# Altium project HT1-1AA.PrjPcb
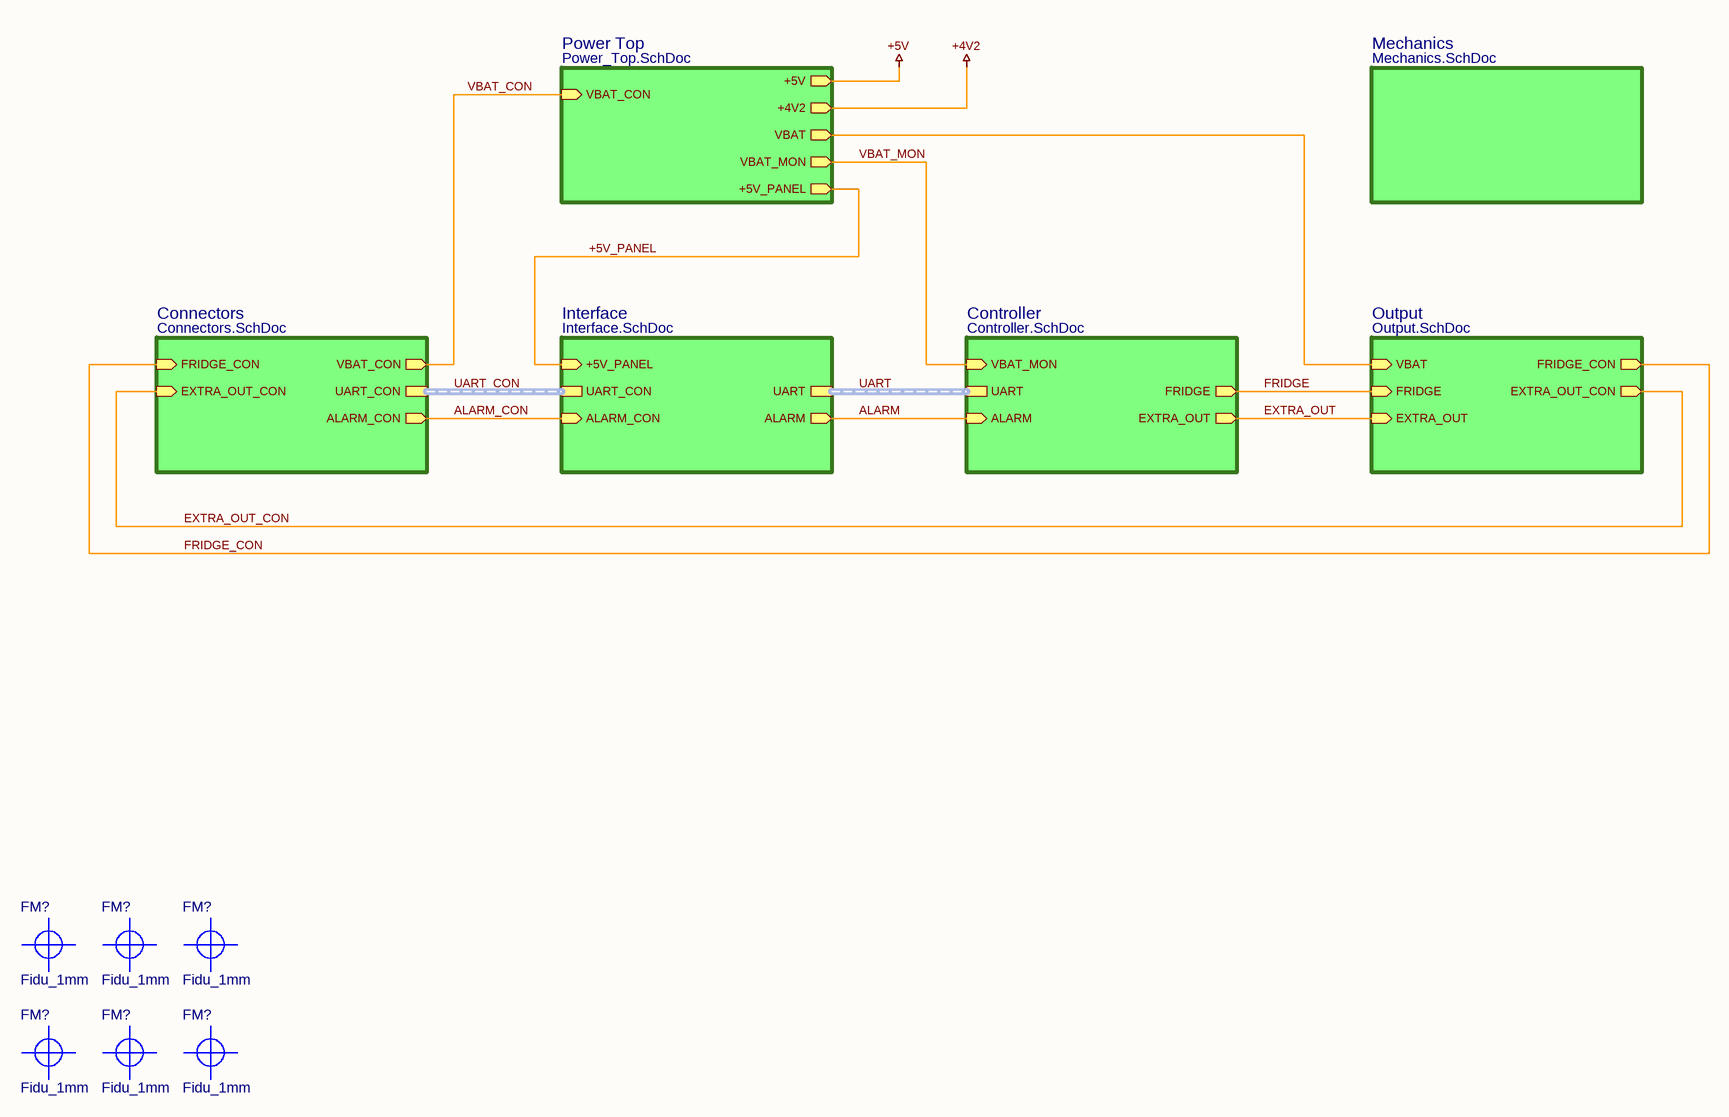
[diagram p0: HT1-1-Top.SchDoc]
Author: ahorat / daniw; Index_Main: A; Index_Sub: A; Layout_Designer: daniw; PCB_NAME: HT1-1; Project: HT Smart Control; Schema_Designer: daniw
10 sheets, 38 parts. Net scope: hierarchical (ports join the sheet entries above them; power ports are global).
Board files: HT1-1A-BASIS.PcbDoc, HT1-1A-PANEL.PcbDoc
Sheets:
  HT1-1-Top.SchDoc
    Controller = Controller.SchDoc
    Mechanics = Mechanics.SchDoc
    Interface = Interface.SchDoc
    Output = Output.SchDoc
    Power Top = Power_Top.SchDoc
      Power 5V = Power-5V.SchDoc
      Power 4.2V = Power-4V2.SchDoc
      Power 5V Panel = Power-5V-Panel.SchDoc
    Connectors = Connectors.SchDoc

## Sheet HT1-1-Top.SchDoc: Top
size A3; Author: daniw; SheetNumber: 1; SheetTotal: 10

### Parts
(Parts that share a designator on the sheet are numbered #1, #2 ... from top to bottom, then left to right.)
FM?#1  Fidu_1mm  [FIDU]  (no BOM)
FM?#2  Fidu_1mm  [FIDU]  (no BOM)
FM?#3  Fidu_1mm  [FIDU]  (no BOM)
FM?#4  Fidu_1mm  [FIDU]  (no BOM)
FM?#5  Fidu_1mm  [FIDU]  (no BOM)
FM?#6  Fidu_1mm  [FIDU]  (no BOM)

### Sub-sheets
Connectors = Connectors.SchDoc: UART_CON (harness UART), ALARM_CON (out), EXTRA_OUT_CON (in), FRIDGE_CON (in), VBAT_CON (out)
Controller = Controller.SchDoc: UART (harness UART), ALARM (in), FRIDGE (out), EXTRA_OUT (out), VBAT_MON (in)
Interface = Interface.SchDoc: UART (harness UART), UART_CON (harness UART), ALARM (out), ALARM_CON (in), +5V_PANEL (in)
Mechanics = Mechanics.SchDoc: no entries
Output = Output.SchDoc: FRIDGE (in), EXTRA_OUT (in), FRIDGE_CON (out), EXTRA_OUT_CON (out), VBAT (in)
Power Top = Power_Top.SchDoc: VBAT_CON (in), +5V (out), +4V2 (out), VBAT_MON (out), +5V_PANEL (out), VBAT (out)

### Nets
+5V_PANEL: sheet Interface/+5V_PANEL, sheet Power Top/+5V_PANEL
ALARM: sheet Controller/ALARM, sheet Interface/ALARM
ALARM_CON: sheet Interface/ALARM_CON, sheet Connectors/ALARM_CON
EXTRA_OUT: sheet Controller/EXTRA_OUT, sheet Output/EXTRA_OUT
EXTRA_OUT_CON: sheet Output/EXTRA_OUT_CON, sheet Connectors/EXTRA_OUT_CON
FRIDGE: sheet Controller/FRIDGE, sheet Output/FRIDGE
FRIDGE_CON: sheet Output/FRIDGE_CON, sheet Connectors/FRIDGE_CON
VBAT: sheet Output/VBAT, sheet Power Top/VBAT
VBAT_CON: sheet Power Top/VBAT_CON, sheet Connectors/VBAT_CON
VBAT_MON: sheet Controller/VBAT_MON, sheet Power Top/VBAT_MON

### Buses and harness runs
harness UART = sheet Controller/UART = sheet Interface/UART
harness UART_CON = sheet Connectors/UART_CON = sheet Interface/UART_CON

### Notes on the sheet
- Date:
- Size:
- A3
- Schema:
- Layout:

### Library data of the parts
FM?#1-FM?#6 = Fidu_1mm: Fiducial; Manufacturer: NONE; Part Number: Fidu_1mm

## Sheet Controller.SchDoc: Controller
size A3; Organization: Hofmann Travel; SheetNumber: 2; SheetTotal: 10
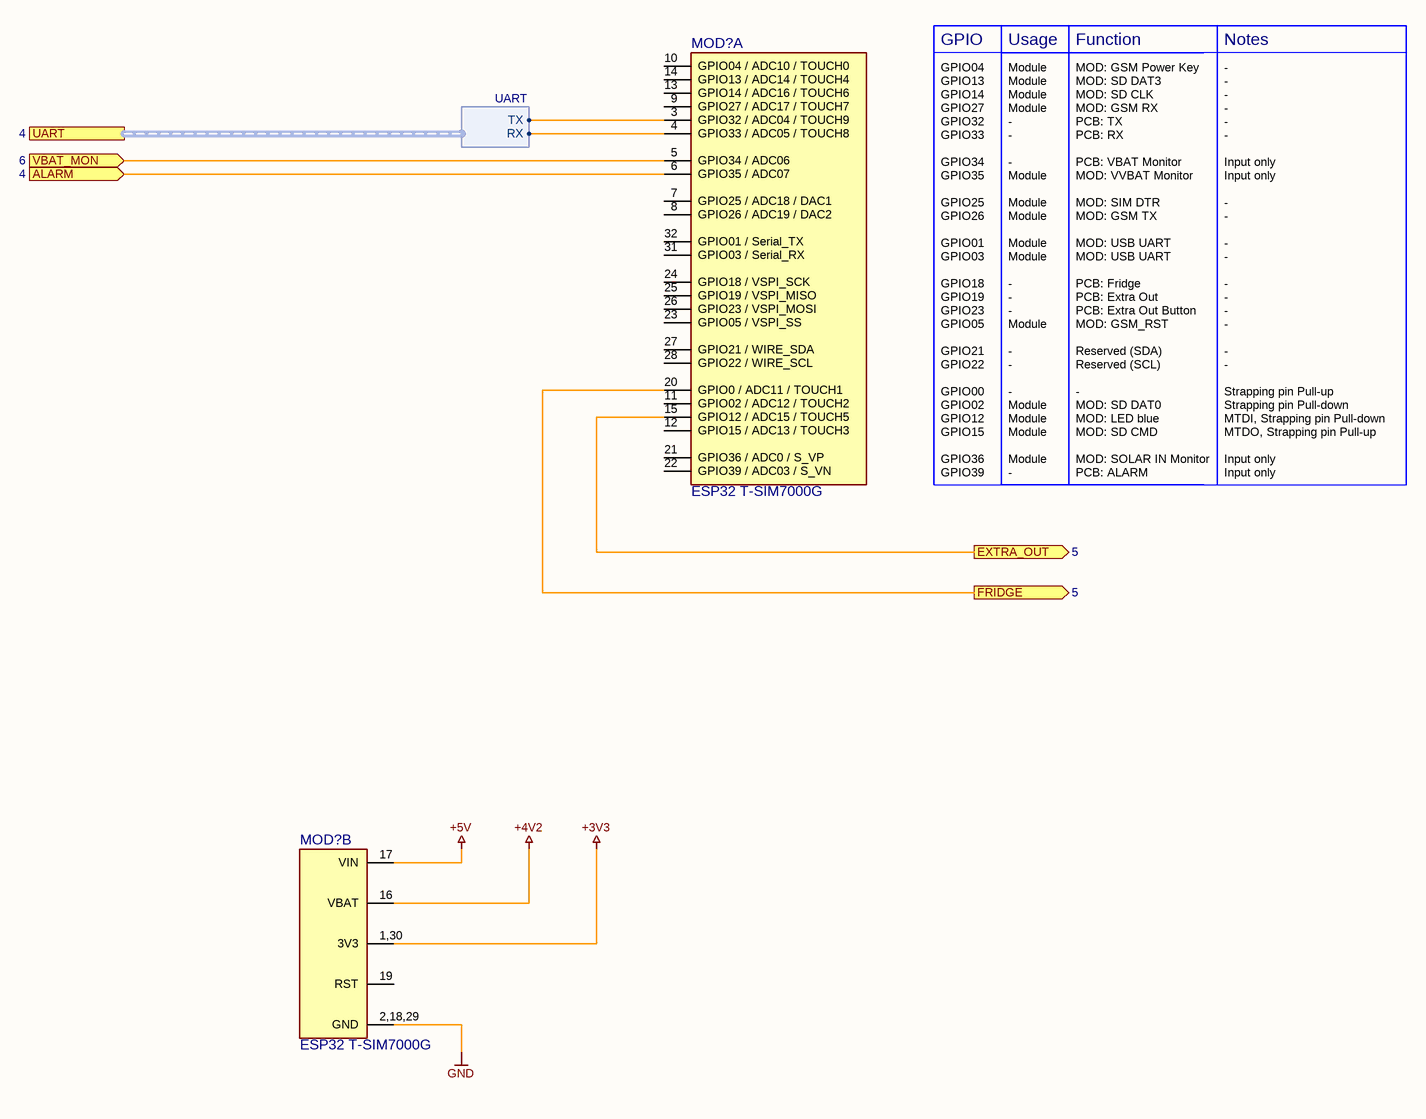
[diagram p1: Controller.SchDoc]

### Parts
(Parts that share a designator on the sheet are numbered #1, #2 ... from top to bottom, then left to right.)
MOD?#1  ESP32 T-SIM7000G  [ESP32-T-SIM7000G]  (part A of 2)
MOD?#2  ESP32 T-SIM7000G  [ESP32-T-SIM7000G]  (part B of 2)

### Ports
ALARM (in, see 4), EXTRA_OUT (out, see 5), FRIDGE (out, see 5), UART (harness UART, see 4), VBAT_MON (in, see 6)

### Harnesses
UART: TX, RX

### Nets
+3V3: MOD?#2.1,30(3V3)
+4V2: MOD?#2.16(VBAT)
+5V: MOD?#2.17(VIN)
GND: MOD?#2.2,18,29(GND)
ALARM: MOD?#1.6(GPIO35_/_ADC07) ; port ALARM
EXTRA_OUT: MOD?#1.15(GPIO12_/_ADC15_/_TOUCH5) ; port EXTRA_OUT
FRIDGE: MOD?#1.20(GPIO0_/_ADC11_/_TOUCH1) ; port FRIDGE
UART.RX: MOD?#1.4(GPIO33_/_ADC05_/_TOUCH8) ; port UART.RX
UART.TX: MOD?#1.3(GPIO32_/_ADC04_/_TOUCH9) ; port UART.TX
VBAT_MON: MOD?#1.5(GPIO34_/_ADC06) ; port VBAT_MON

Not connected (* = marked no-connect by the designer): MOD?#1 7(GPIO25_/_ADC18_/_DAC1) 8(GPIO26_/_ADC19_/_DAC2) 9(GPIO27_/_ADC17_/_TOUCH7) 10(GPIO04_/_ADC10_/_TOUCH0) 11(GPIO02_/_ADC12_/_TOUCH2) 12(GPIO15_/_ADC13_/_TOUCH3) 13(GPIO14_/_ADC16_/_TOUCH6) 14(GPIO13_/_ADC14_/_TOUCH4) 21(GPIO36_/_ADC0_/_S_VP) 22(GPIO39_/_ADC03_/_S_VN) 23(GPIO05_/_VSPI_SS) 24(GPIO18_/_VSPI_SCK) 25(GPIO19_/_VSPI_MISO) 26(GPIO23_/_VSPI_MOSI) 27(GPIO21_/_WIRE_SDA) 28(GPIO22_/_WIRE_SCL) 31(GPIO03_/_Serial_RX) 32(GPIO01_/_Serial_TX); MOD?#2 19(RST)

### Notes on the sheet
- GPIO
- Usage
- Function
- Notes
- GPIO04
  GPIO13
  GPIO14
  GPIO27
  GPIO32
  GPIO33
  GPIO34
  GPIO35
  GPIO25
  GPIO26
  GPIO01
  GPIO03
  GPIO18
  GPIO19
  GPIO23
  GPIO05
  GPIO21
  GPIO22
  GPIO00
  GPIO02
  GPIO12
  GPIO15
  GPIO36
  GPIO39
- Module
  Module
  Module
  Module
  -
  -
  -
  Module
  Module
  Module
  Module
  Module
  -
  -
  -
  Module
  -
  -
  -
  Module
  Module
  Module
  Module
  -
- GSM Power Key
  SD DAT3
  SD CLK
  GSM RX
  -
  -
  -
  VVBAT Monitor
  SIM DTR
  GSM TX
  USB UART
  USB UART
  -
  -
  -
  GSM_RST
  -
  -
  -
  SD DAT0
  LED blue
  SD CMD
  SOLAR IN Monitor
  -
- MOD: GSM Power Key
  MOD: SD DAT3
  MOD: SD CLK
  MOD: GSM RX
  PCB: TX
  PCB: RX
  PCB: VBAT Monitor
  MOD: VVBAT Monitor
  MOD: SIM DTR
  MOD: GSM TX
  MOD: USB UART
  MOD: USB UART
  PCB: Fridge
  PCB: Extra Out
  PCB: Extra Out Button
  MOD: GSM_RST
  Reserved (SDA)
  Reserved (SCL)
  -
  MOD: SD DAT0
  MOD: LED blue
  MOD: SD CMD
  MOD: SOLAR IN Monitor
  PCB: ALARM
- -
  -
  -
  -
  -
  -
  Input only
  Input only
  -
  -
  -
  -
  -
  -
  -
  -
  -
  -
  Strapping pin Pull-up
  Strapping pin Pull-down
  MTDI, Strapping pin Pull-down
  MTDO, Strapping pin Pull-up
  Input only
  Input only
- Date:
- Size:
- A3
- Schema:
- Layout:

### Library data of the parts
MOD?#1 MOD?#2 = ESP32 T-SIM7000G: ESP32 T-SIM7000G ESP32 SIM Card T-SIM7000G module; Manufacturer: Xinyuan LilyGO; Part Number: ESP32 T-SIM7000G; Package: Module; HelpURL: https://github.com/Xinyuan-LilyGO/LilyGO-T-SIM7000G; Manufacturer 1: Xinyuan LilyGO

## Sheet Mechanics.SchDoc: Mechanics
size A3; Organization: Hofmann Travel; SheetNumber: 9; SheetTotal: 9

### Notes on the sheet
- Date:
- Size:
- A3
- Schema:
- Layout:

## Sheet Interface.SchDoc: Interface
size A3; Organization: Hofmann Travel; SheetNumber: 4; SheetTotal: 10
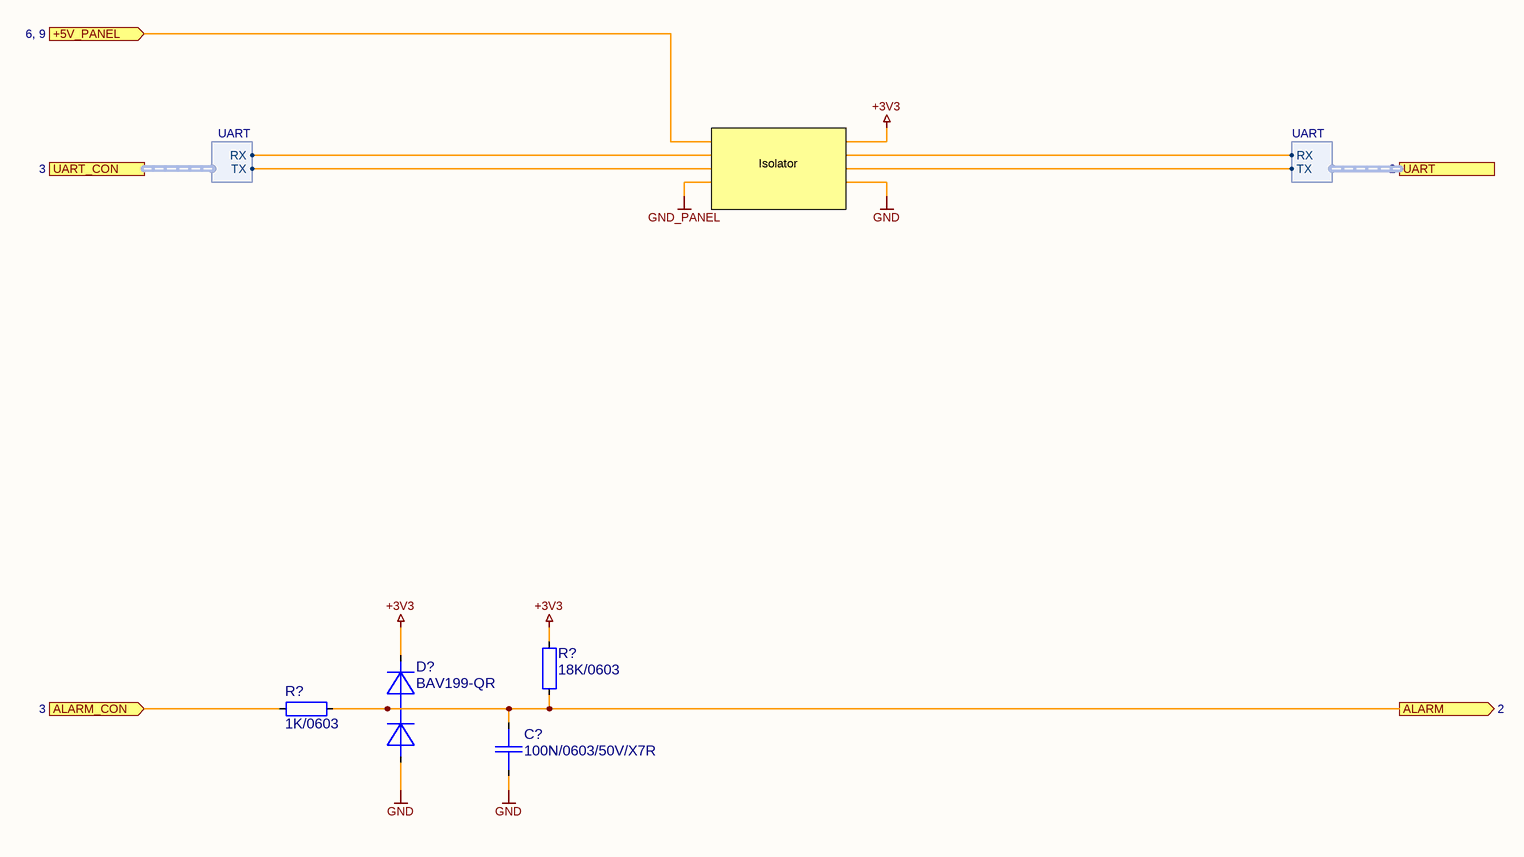
[diagram p2: Interface.SchDoc]

### Parts
(Parts that share a designator on the sheet are numbered #1, #2 ... from top to bottom, then left to right.)
C?#1  100N/0603/50V/X7R  [CAP0603_X7R]
D?#1  BAV199-QR  [SOT2395P280X125-3-SE]
R?#1  18K/0603  [R0603-0.40-WW]
R?#2  1K/0603  [R0603-0.40-WW]

### Ports
+5V_PANEL (in, see 6, 9), ALARM (out, see 2), ALARM_CON (in, see 3), UART (harness UART, see 2), UART_CON (harness UART, see 3)

### Harnesses
UART: RX, TX

### Nets
+3V3: D?#1.2(K2) R?#1.1
GND: C?#1.2 D?#1.1(A1)
ALARM: C?#1.1 D?#1.3(K1/A2) R?#1.2 R?#2.2 ; port ALARM
ALARM_CON: R?#2.1 ; port ALARM_CON

### Notes on the sheet
- Isolator
- Date:
- Size:
- A3
- Schema:
- Layout:

### Library data of the parts
C?#1 = 100N/0603/50V/X7R: CAP SM 0603 100nF 50V X7R; Manufacturer: GENERIC; Manufacturer 1: YAGEO; Manufacturer Part Number 1: CC0603KPX7R9BB104; Absolute Value: 1E-7; Eurocircuits GPN: GPC0603104; Part Number: 100N/0603/50V/X7R; Package: 0603; Value: 100nF; HelpURL: https://www.yageo.com/upload/media/product/app/datasheet/mlcc/upy-gphc_x7r_6_3v-to-250v.pdf; Supplier 1: Digi-Key; Supplier Part Number 1: 311-3567-1-ND; Manufacturer 2: YAGEO; Manufacturer Part Number 2: CC0603MRX7R9BB104; Supplier 2: Digi-Key; Supplier Part Number 2: 311-4110-1-ND; Supplier 3: LCSC; Supplier Part Number 3: C14663; JLC Type: Basic
D?#1 = BAV199-QR: Low-leakage double diode; Manufacturer: Nexperia USA Inc.; Absolute Value: 75V; Part Number: BAV199-QR; Package: SOT23; Value: BAV199-QR; HelpURL: https://assets.nexperia.com/documents/data-sheet/BAV199-Q.pdf; Manufacturer 1: Nexperia USA Inc.; Manufacturer Part Number 1: BAV199-QR; Supplier 1: Digikey; Supplier Part Number 1: 1727-BAV199-QRCT-ND; Manufacturer 3: Jiangsu Changjing Electronics Technology Co., Ltd.; Manufacturer Part Number 3: BAV199; Supplier 3: LCSC; Supplier Part Number 3: C68971
R?#1 = 18K/0603: RES SM 0603 18K; Manufacturer: GENERIC; Manufacturer 1: YAGEO; Manufacturer Part Number 1: RC0603FR-1318KL; Absolute Value: 18000; Eurocircuits GPN: GPR060318K; Part Number: 18K/0603; Package: 0603; Value: 18K; HelpURL: https://www.yageo.com/upload/media/product/productsearch/datasheet/rchip/PYu-RC_Group_51_RoHS_L_12.pdf; Supplier 1: Digi-Key; Supplier Part Number 1: 13-RC0603FR-1318KLCT-ND; Manufacturer 2: YAGEO; Manufacturer Part Number 2: RC0603FR-1018KL; Supplier 2: Digi-Key; Supplier Part Number 2: 13-RC0603FR-1018KLCT-ND
R?#2 = 1K/0603: RES SM 0603 1K; Manufacturer: GENERIC; Manufacturer 1: YAGEO; Manufacturer Part Number 1: RC0603FR-131KL; Absolute Value: 1000; Eurocircuits GPN: GPR06031K; Part Number: 1K/0603; Package: 0603; Value: 1K; HelpURL: https://www.yageo.com/upload/media/product/app/datasheet/rchip/pyu-rc_group_51_rohs_l.pdf; Supplier 1: Digi-Key; Supplier Part Number 1: 13-RC0603FR-131KLCT-ND; Manufacturer 2: YAGEO; Manufacturer Part Number 2: RC0603FR-101KL; Supplier 2: Digi-Key; Supplier Part Number 2: 13-RC0603FR-101KLCT-ND; Manufacturer 3: UNI-ROYAL(Uniroyal Elec); Manufacturer Part Number 3: 0603WAF1001T5E; Supplier 3: LCSC; Supplier Part Number 3: C21190; JLC Type: Basic

## Sheet Output.SchDoc: Output
size A3; Organization: Hofmann Travel; SheetNumber: 5; SheetTotal: 10
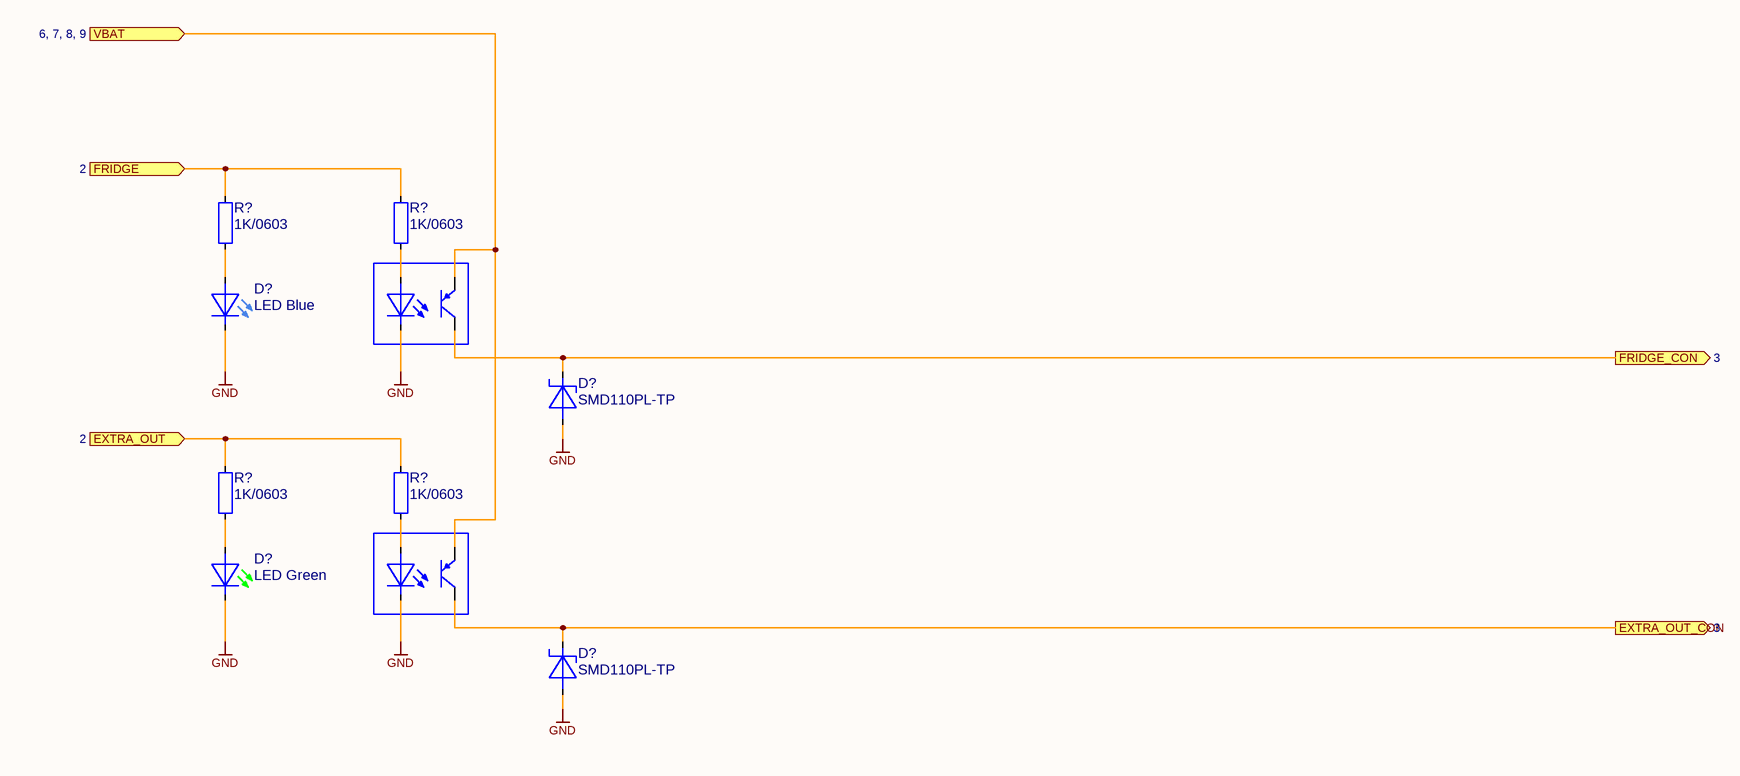
[diagram p3: Output.SchDoc]

### Parts
(Parts that share a designator on the sheet are numbered #1, #2 ... from top to bottom, then left to right.)
D?#2  LED Blue  [LED0603_BLUE]
D?#3  LED White  [LED0603_WHITE]  (value not drawn)
D?#4  SMD110PL-TP  [SOD3718X125]
D?#5  LED Green  [LED0603_GREEN]
D?#6  LED White  [LED0603_WHITE]  (value not drawn)
D?#7  SMD110PL-TP  [SOD3718X125]
Q?#1  MMBT4403L  [SOT2395P280X125-3-SE]  (value not drawn)
Q?#2  MMBT4403L  [SOT2395P280X125-3-SE]  (value not drawn)
R?#3  1K/0603  [R0603-0.40-WW]
R?#4  1K/0603  [R0603-0.40-WW]
R?#5  1K/0603  [R0603-0.40-WW]
R?#6  1K/0603  [R0603-0.40-WW]

### Ports
EXTRA_OUT (in, see 2), EXTRA_OUT_CON (out, see 3), FRIDGE (in, see 2), FRIDGE_CON (out, see 3), VBAT (in, see 6, 7, 8, 9)

### Nets
GND: D?#2.1 D?#3.1 D?#4.2 D?#5.1 D?#6.1 D?#7.2
EXTRA_OUT: R?#5.1 R?#6.1 ; port EXTRA_OUT
EXTRA_OUT_CON: D?#7.1 Q?#2.3(COLLECTOR) ; port EXTRA_OUT_CON
FRIDGE: R?#3.1 R?#4.1 ; port FRIDGE
FRIDGE_CON: D?#4.1 Q?#1.3(COLLECTOR) ; port FRIDGE_CON
VBAT: Q?#1.2(EMITTER) Q?#2.2(EMITTER) ; port VBAT
NetD?#2_2: D?#2.2 R?#3.2
NetD?#3_2: D?#3.2 R?#4.2
NetD?#5_2: D?#5.2 R?#5.2
NetD?#6_2: D?#6.2 R?#6.2

Not connected (* = marked no-connect by the designer): Q?#1 1(BASE); Q?#2 1(BASE)

### Notes on the sheet
- Date:
- Size:
- A3
- Schema:
- Layout:

### Library data of the parts
D?#2 = LED BLUE 0603: Generic LED Blue 0603; Manufacturer 1: Würth; Manufacturer Part Number 1: 150060BS75000; Part Number: LED Blue 0603; Manufacturer: GENERIC; Package: 603; Value: Blue; Absolute Value: Blue; HelpURL: https://www.we-online.com/katalog/datasheet/150060BS75000.pdf; Supplier 1: Digikey; Supplier Part Number 1: 732-4966-1-ND; Manufacturer 3: Everlight Elec; Manufacturer Part Number 3: 19-217/BHC-ZL1M2RY/3T; Supplier 3: LCSC; Supplier Part Number 3: C72041; JLC Type: Basic
D?#3 D?#6 = LED WHITE 0603: Generic LED White 0603; Manufacturer 1: Inolux; Manufacturer Part Number 1: IN-S63BT5UW; Part Number: LED White 0603; Manufacturer: GENERIC; Package: 603; Value: White; Absolute Value: White; HelpURL: https://www.inolux-corp.com/datasheet/SMDLED/Mono%20Color%20Top%20View/IN-S63BT%20Series_V1.0.pdf; Supplier 1: Digikey; Supplier Part Number 1: 1830-1070-1-ND; Manufacturer 3: Hubei KENTO Elec; Manufacturer Part Number 3: KT-0603W; Supplier 3: LCSC; Supplier Part Number 3: C2290; JLC Type: Basic
D?#4 D?#7 = SMD110PL-TP: Schottky 100 V 1A Oberflächenmontage SOD-123FL; Manufacturer: Micro Commercial Co; Absolute Value: 100V; Part Number: SMD110PL-TP; Package: SOD-123FL; Value: SMD110PL-TP; HelpURL: https://www.mccsemi.com/pdf/Products/SMD110PL-SMD1200PL(SOD-123FL).pdf; Manufacturer 1: Micro Commercial Co; Manufacturer Part Number 1: SMD110PL-TP; Supplier 1: Digikey; Supplier Part Number 1: SMD110PL-TPMSCT-ND
D?#5 = LED GREEN 0603: Generic LED Green 0603; Manufacturer 1: Würth; Manufacturer Part Number 1: 150060VS75000; Part Number: LED Green 0603; Manufacturer: GENERIC; Package: 603; Value: Green; Absolute Value: Green; HelpURL: https://www.we-online.com/katalog/datasheet/150060VS75000.pdf; Supplier 1: Digikey; Supplier Part Number 1: 732-4980-1-ND; Manufacturer 3: Everlight Elec; Manufacturer Part Number 3: 19-217/GHC-YR1S2/3T; Supplier 3: LCSC; Supplier Part Number 3: C72043; JLC Type: Basic
Q?#1 Q?#2 = MMBT4403L: Switching Transistor PNP Silicon; Manufacturer: ON SEMI; Part Number: MMBT4403L; Package: SOT23; HelpURL: https://www.onsemi.com/pdf/datasheet/mmbt4403lt1-d.pdf; Manufacturer 3: ONSEMI; Manufacturer Part Number 3: MMBT4403LT1G; Supplier 3: LCSC; Supplier Part Number 3: C78864; JLC Type: Extended
R?#3-R?#6 = 1K/0603: as R?#2 on sheet Interface; Part Number: 1K/0603; Package: 0603; Value: 1K; HelpURL: https://www.yageo.com/upload/media/product/app/datasheet/rchip/pyu-rc_group_51_rohs_l.pdf; Supplier 1: Digi-Key; Supplier Part Number 1: 13-RC0603FR-131KLCT-ND; Manufacturer 2: YAGEO; Manufacturer Part Number 2: RC0603FR-101KL; Supplier 2: Digi-Key; Supplier Part Number 2: 13-RC0603FR-101KLCT-ND; Manufacturer 3: UNI-ROYAL(Uniroyal Elec); Manufacturer Part Number 3: 0603WAF1001T5E; Supplier 3: LCSC; Supplier Part Number 3: C21190; JLC Type: Basic

## Sheet Power_Top.SchDoc: Power Top
size A3; Organization: Hofmann Travel; SheetNumber: 6; SheetTotal: 10
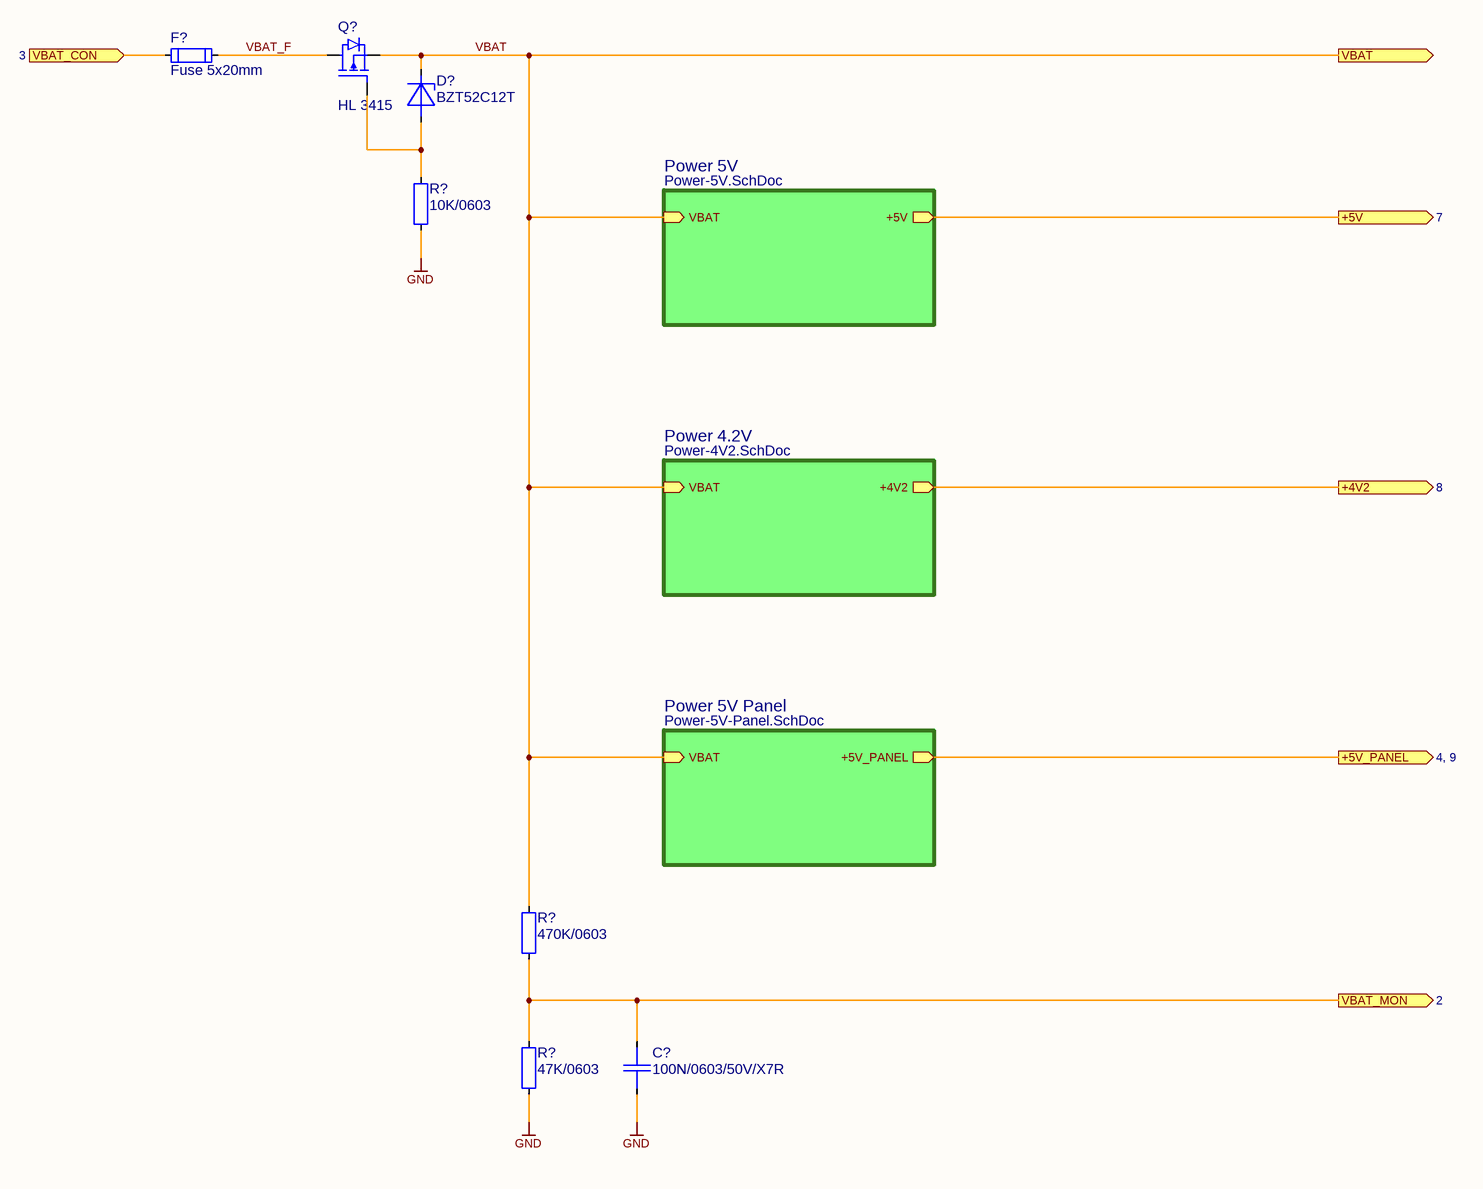
[diagram p4: Power_Top.SchDoc]

### Parts
(Parts that share a designator on the sheet are numbered #1, #2 ... from top to bottom, then left to right.)
C?#2  100N/0603/50V/X7R  [CAP0603_X7R]
D?#8  BZT52C12T  [SOD1608X065]
F?  Fuse 5x20mm  [OGN_THR]
Q?#3  HL 3415  [SOT2395P280X125-3-SE]
R?#7  10K/0603  [R0603-0.40-WW]
R?#8  470K/0603  [R0603-0.40-WW]
R?#9  47K/0603  [R0603-0.40-WW]

### Sub-sheets
Power 4.2V = Power-4V2.SchDoc: VBAT (in), +4V2 (out)
Power 5V = Power-5V.SchDoc: VBAT (in), +5V (out)
Power 5V Panel = Power-5V-Panel.SchDoc: VBAT (in), +5V_PANEL (out)

### Ports
+4V2 (out, see 8), +5V (out, see 7), +5V_PANEL (out, see 4, 9), VBAT (out), VBAT_CON (in, see 3), VBAT_MON (out, see 2)

### Nets
+4V2: port +4V2, sheet Power 4.2V/+4V2
+5V: port +5V, sheet Power 5V/+5V
GND: C?#2.2 R?#7.2 R?#9.2
+5V_PANEL: port +5V_PANEL, sheet Power 5V Panel/+5V_PANEL
VBAT: D?#8.1 Q?#3.2(SOURCE) R?#8.1 ; port VBAT, sheet Power 5V/VBAT, sheet Power 4.2V/VBAT, sheet Power 5V Panel/VBAT
VBAT_CON: F?.1 ; port VBAT_CON
VBAT_F: F?.2 Q?#3.3(DRAIN)
VBAT_MON: C?#2.1 R?#8.2 R?#9.1 ; port VBAT_MON
NetD?#8_2: D?#8.2 Q?#3.1(GATE) R?#7.1

### Notes on the sheet
- Date:
- Size:
- A3
- Schema:
- Layout:

### Library data of the parts
C?#2 = 100N/0603/50V/X7R: as C?#1 on sheet Interface; Part Number: 100N/0603/50V/X7R; Package: 0603; Value: 100nF; HelpURL: https://www.yageo.com/upload/media/product/app/datasheet/mlcc/upy-gphc_x7r_6_3v-to-250v.pdf; Supplier 1: Digi-Key; Supplier Part Number 1: 311-3567-1-ND; Manufacturer 2: YAGEO; Manufacturer Part Number 2: CC0603MRX7R9BB104; Supplier 2: Digi-Key; Supplier Part Number 2: 311-4110-1-ND; Supplier 3: LCSC; Supplier Part Number 3: C14663; JLC Type: Basic
D?#8 = BZT52C12T: DIODE ZENER 12V 100MW SOD523; Manufacturer: Micro Commercial Co; Manufacturer Part Number 1: BZT52C12T-TP; Part Number: BZT52C12T; Package: SC-79, SOD-523; Value: BZT52C12T; Absolute Value: 12 V; HelpURL: https://www.mccsemi.com/pdf/Products/BZT52C(B)2V4T-BZT52C(B)39T(SOD-523).pdf; Manufacturer 1: Micro Commercial Co; Supplier 1: Digikey; Supplier Part Number 1: BZT52C12T-TPMSCT-ND; Manufacturer 2: Diodes Incorporated; Manufacturer Part Number 2: BZT52C12T-7; Supplier 2: Digikey; Supplier Part Number 2: BZT52C12T-7DICT-ND
F? = Fuse/5x20mm/OGN: open fuse holder, 5 x 20 mm, THR, IEC 60335-1; Manufacturer: Schurter; Manufacturer Part Number 1: 3-132-873; Part Number: Fuse/5x20mm/OGN; Package: 5X20; HelpURL: https://www.schurter.com/en/datasheet/typ_OGN.pdf; Manufacturer 1: Schurter; Supplier 1: Digi-Key; Supplier Part Number 1: 486-3-132-873-ND
Q?#3 = HL 3415: P-CH 20V Fast Switching MOSFETs; Manufacturer: GENERIC; Part Number: HL 3415; Package: SOT23; HelpURL: https://datasheet.lcsc.com/lcsc/2306211455_HL-3415_C7431444.pdf; Manufacturer 3: HL; Manufacturer Part Number 3: HL 3415; Supplier 3: LCSC; Supplier Part Number 3: C7431444
R?#7 = 10K/0603: RES SM 0603 10K; Manufacturer: GENERIC; Manufacturer 1: YAGEO; Manufacturer Part Number 1: RC0603FR-1310KL; Absolute Value: 10000; Eurocircuits GPN: GPR060310K; Part Number: 10K/0603; Package: 0603; Value: 10K; HelpURL: https://www.yageo.com/upload/media/product/productsearch/datasheet/rchip/PYu-RC_Group_51_RoHS_L_12.pdf; Supplier 1: Digi-Key; Supplier Part Number 1: 13-RC0603FR-1310KLCT-ND; Manufacturer 2: YAGEO; Manufacturer Part Number 2: RC0603FR-1010KL; Supplier 2: Digi-Key; Supplier Part Number 2: 13-RC0603FR-1010KLCT-ND; Manufacturer 3: UNI-ROYAL(Uniroyal Elec); Manufacturer Part Number 3: 0603WAF1002T5E; Supplier 3: LCSC; Supplier Part Number 3: C25804; JLC Type: Basic
R?#8 = 470K/0603: RES SM 0603 470K; Manufacturer: GENERIC; Manufacturer 1: YAGEO; Manufacturer Part Number 1: RC0603FR-13470KL; Absolute Value: 470000; Eurocircuits GPN: GPR0603470K; Part Number: 470K/0603; Package: 0603; Value: 470K; HelpURL: https://www.yageo.com/upload/media/product/app/datasheet/rchip/pyu-rc_group_51_rohs_l.pdf; Supplier 1: Digi-Key; Supplier Part Number 1: 13-RC0603FR-13470KLCT-ND; Manufacturer 2: YAGEO; Manufacturer Part Number 2: RC0603FR-10470KL; Supplier 2: Digi-Key; Supplier Part Number 2: 13-RC0603FR-10470KLCT-ND
R?#9 = 47K/0603: RES SM 0603 47K; Manufacturer: GENERIC; Manufacturer 1: YAGEO; Manufacturer Part Number 1: RC0603FR-1347KL; Absolute Value: 47000; Eurocircuits GPN: GPR060347K; Part Number: 47K/0603; Package: 0603; Value: 47K; HelpURL: https://www.yageo.com/upload/media/product/app/datasheet/rchip/pyu-rc_group_51_rohs_l.pdf; Supplier 1: Digi-Key; Supplier Part Number 1: 13-RC0603FR-1347KLCT-ND; Manufacturer 2: YAGEO; Manufacturer Part Number 2: RC0603FR-1047KL; Supplier 2: Digi-Key; Supplier Part Number 2: 13-RC0603FR-1047KLCT-ND; Manufacturer 3: UNI-ROYAL(Uniroyal Elec); Manufacturer Part Number 3: 0603WAF4702T5E; Supplier 3: LCSC; Supplier Part Number 3: C25819; JLC Type: Basic

## Sheet Power-5V.SchDoc: Power +5V
size A3; Organization: Hofmann Travel; SheetNumber: 7; SheetTotal: 10
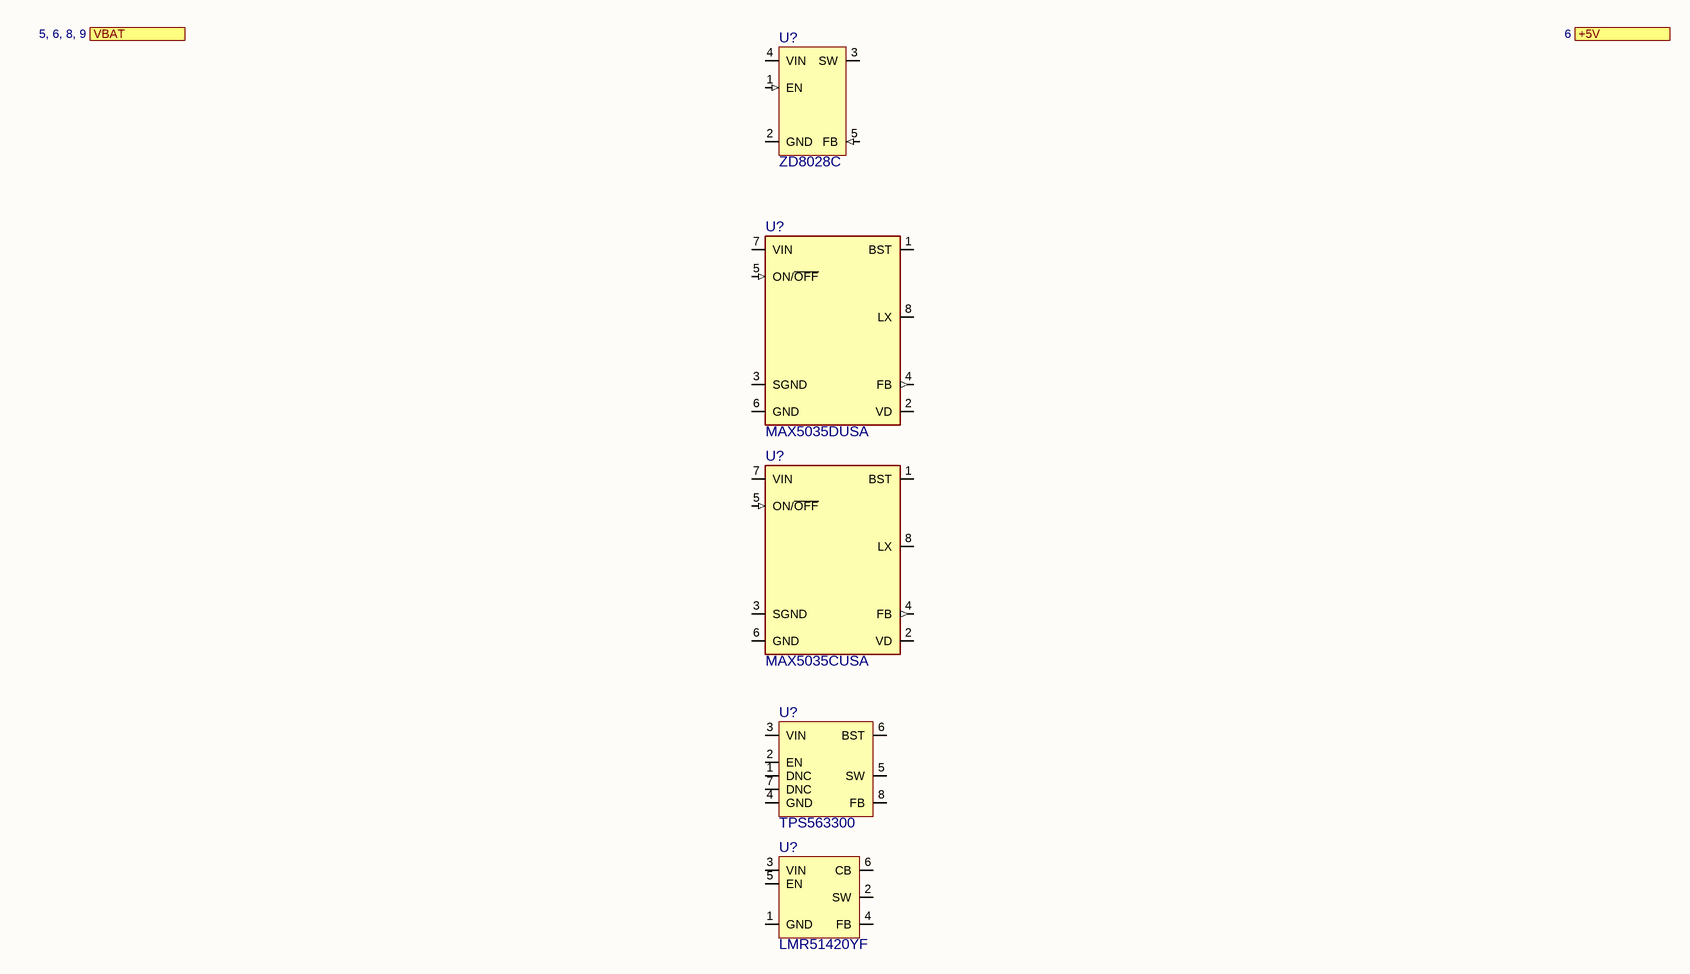
[diagram p5: Power-5V.SchDoc]

### Parts
(Parts that share a designator on the sheet are numbered #1, #2 ... from top to bottom, then left to right.)
U?#1  ZD8028C  [SOT2395P280X125-5-SW]
U?#2  MAX5035DUSA  [SOP127P600X155-8-SW]
U?#3  MAX5035CUSA  [SOP127P600X155-8-SW]
U?#4  TPS563300  [SOT50P160X60-8-SE]
U?#5  LMR51420YF  [SOT2395P280X125-6-NW]

### Ports
+5V (out, see 6), VBAT (in, see 5, 6, 8, 9)

### Nets

Not connected (* = marked no-connect by the designer): U?#1 1(EN) 2(GND) 3(SW) 4(VIN) 5(FB); U?#2 1(BST) 2(VD) 3(SGND) 4(FB) 5(ON/~{OFF}) 6(GND) 7(VIN) 8(LX); U?#3 1(BST) 2(VD) 3(SGND) 4(FB) 5(ON/~{OFF}) 6(GND) 7(VIN) 8(LX); U?#4 1(DNC) 2(EN) 3(VIN) 4(GND) 5(SW) 6(BST) 7(DNC) 8(FB); U?#5 1(GND) 2(SW) 3(VIN) 4(FB) 5(EN) 6(CB)

### Notes on the sheet
- Date:
- Size:
- A3
- Schema:
- Layout:

### Library data of the parts
U?#1 = ZD8028C: 1.5A 2MHz 5.5V Synchronous Buck Converter; Manufacturer: Zetta; Part Number: ZD8028C; Package: SOT23-5; HelpURL: https://datasheet.lcsc.com/lcsc/2203221830_Zetta-ZD8028IB5TR_C2928932.pdf; Manufacturer 3: Zetta; Manufacturer Part Number 3: ZD8028IB5TR; Supplier 3: LCSC; Supplier Part Number 3: C2928932; JLC Type: Extended
U?#2 = MAX5035DUSA: 1A, 76V Adj, High-Efficiency MAXPower Step-Down DC-DC Converter; Manufacturer: Analog Devices Inc./Maxim Integrated; Manufacturer Part Number 1: MAX5035DUSA+T; Part Number: MAX5035DUSA; Package: SOIC-8; HelpURL: https://www.analog.com/media/en/technical-documentation/data-sheets/max5035.pdf; Manufacturer 1: Analog Devices Inc./Maxim Integrated; Supplier 1: Digi-Key; Supplier Part Number 1: MAX5035DUSA+TCT-ND; Manufacturer 3: Analog Devices Inc./Maxim Integrated; Manufacturer Part Number 3: MAX5035DASA+T; Supplier 3: LCSC; Supplier Part Number 3: C15940
U?#3 = MAX5035CUSA: 1A 76V to 12V High-Efficiency MAXPower Step-Down DC-DC Converter; Manufacturer: Analog Devices Inc./Maxim Integrated; Manufacturer Part Number 1: MAX5035CUSA+; Part Number: MAX5035CUSA; Package: SOIC-8; HelpURL: https://www.analog.com/media/en/technical-documentation/data-sheets/max5035.pdf; Manufacturer 1: Analog Devices Inc./Maxim Integrated; Supplier 1: Digi-Key; Supplier Part Number 1: MAX5035CUSA+-ND
U?#4 = TPS563300: 3.8-V to 28-V, 3-A Synchronous Buck Converter in SOT583 Package; Manufacturer: Texas Instruments; Manufacturer Part Number 1: TPS563300DRLR; Part Number: TPS563300; Package: SOT-583; HelpURL: https://www.ti.com/lit/ds/symlink/tps563300.pdf; Manufacturer 1: Texas Instruments; Supplier 1: Digi-Key; Supplier Part Number 1: TPS563300DRLR; Manufacturer 3: Texas Instruments; Manufacturer Part Number 3: TPS563300DRLR; Supplier 3: LCSC; Supplier Part Number 3: C5219249
U?#5 = LMR51420YF: SIMPLE SWITCHER® power converter 4.5-V to 36-V, 2-A, synchronous buck with 40-µA IQ; Manufacturer: Texas Instruments; Manufacturer Part Number 1: LMR51420YFDDCR; Part Number: LMR51420YF; Package: SOIC-8; HelpURL: https://www.ti.com/lit/ds/symlink/lmr51420.pdf; Manufacturer 1: Texas Instruments; Supplier 1: Digi-Key; Supplier Part Number 1: 296-LMR51420YFDDCRCT-ND; Manufacturer 3: Texas Instruments; Manufacturer Part Number 3: LMR51420YFDDCR; Supplier 3: LCSC; Supplier Part Number 3: C7296200

## Sheet Power-4V2.SchDoc: Power +4V2
size A3; Organization: Hofmann Travel; SheetNumber: 8; SheetTotal: 10
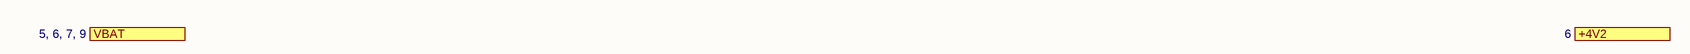
[diagram p6: Power-4V2.SchDoc]

### Ports
+4V2 (out, see 6), VBAT (in, see 5, 6, 7, 9)

### Notes on the sheet
- Date:
- Size:
- A3
- Schema:
- Layout:

## Sheet Power-5V-Panel.SchDoc: Power +5V Panel
size A3; Organization: Hofmann Travel; SheetNumber: 9; SheetTotal: 10
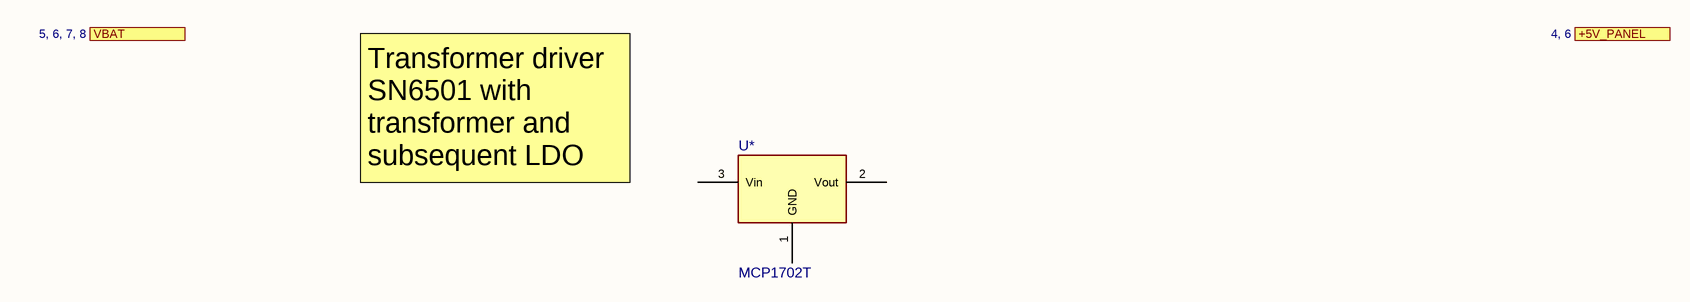
[diagram p7: Power-5V-Panel.SchDoc]

### Parts
U*  MCP1702T  [SOT2395P280X125-3-SE]

### Ports
+5V_PANEL (out, see 4, 6), VBAT (in, see 5, 6, 7, 8)

### Nets

Not connected (* = marked no-connect by the designer): U* 1(GND) 2(Vout) 3(Vin)

### Notes on the sheet
- Transformer driver SN6501 with transformer and subsequent LDO
- Date:
- Size:
- A3
- Schema:
- Layout:

### Library data of the parts
U* = MCP1702T-4002E/CB: Linear Voltage Regulator IC Positive Fixed 1 Output 250mA SOT-23A-3; Manufacturer: Microchip Technology; Manufacturer 1: Microchip; Part Number: MCP1702T-4002E/CB; Package: SOT23; HelpURL: https://ww1.microchip.com/downloads/en/DeviceDoc/22008E.pdf; Manufacturer Part Number 1: MCP1702T-4002E/CB; Supplier 1: Digi-Key; Supplier Part Number 1: MCP1702T-4002E/CBCT-ND; Manufacturer 3: Microne; Manufacturer Part Number 3: ME6209A40M3G; Supplier 3: LCSC; Supplier Part Number 3: C83509

## Sheet Connectors.SchDoc: Connector
size A3; Organization: Hofmann Travel; SheetNumber: 3; SheetTotal: 10
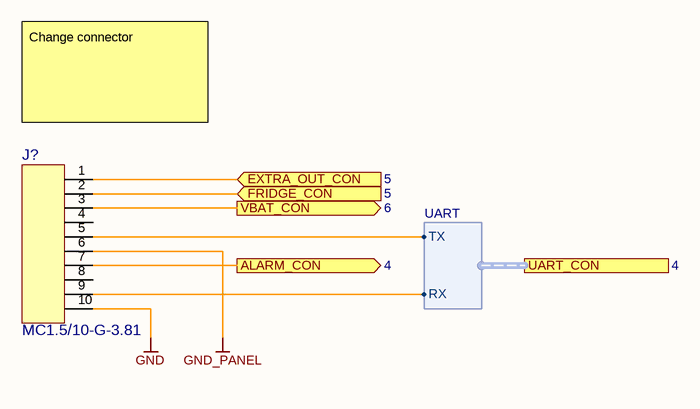
[diagram p8: Connectors.SchDoc]

### Parts
J?  MC1.5/10-G-3.81  [MC1.5/10-G-3.81]

### Ports
ALARM_CON (out, see 4), EXTRA_OUT_CON (in, see 5), FRIDGE_CON (in, see 5), UART_CON (harness UART, see 4), VBAT_CON (out, see 6)

### Harnesses
UART: TX, RX

### Nets
GND: J?.10
GND_PANEL: J?.6
ALARM_CON: J?.7 ; port ALARM_CON
EXTRA_OUT_CON: J?.1 ; port EXTRA_OUT_CON
FRIDGE_CON: J?.2 ; port FRIDGE_CON
UART_CON.RX: J?.9 ; port UART_CON.RX
UART_CON.TX: J?.5 ; port UART_CON.TX
VBAT_CON: J?.3 ; port VBAT_CON

Not connected (* = marked no-connect by the designer): J? 4 8

### Notes on the sheet
- Change connector
- Date:
- Size:
- A3
- Schema:
- Layout:

### Library data of the parts
J? = MC1.5/10-G-3.81: Phoenix contact MC 1,5/ 10-G-3,81; Manufacturer Part Number 1: 1803358; Part Number: MC1.5/10-G-3.81; Manufacturer: Phoenix; HelpURL: https://www.phoenixcontact.com/en-us/products/pcb-header-mc-1510-g-381-1803358?type=pdf; Manufacturer 1: Phoenix; Supplier 1: Digi-Key; Supplier Part Number 1: 277-1214-ND

## Nets that join several sheets
+3V3: Controller (MOD?#2.1,30), Interface (D?#1.2 R?#1.1)
GND: Controller (MOD?#2.2,18,29), Interface (C?#1.2 D?#1.1), Output (6 pins), Power_Top (C?#2.2 R?#7.2 R?#9.2), Connectors (J?.10)
ALARM: Controller (MOD?#1.6), Interface (C?#1.1 D?#1.3 R?#1.2 R?#2.2)
ALARM_CON: Interface (R?#2.1), Connectors (J?.7)
EXTRA_OUT: Controller (MOD?#1.15), Output (R?#5.1 R?#6.1)
EXTRA_OUT_CON: Output (D?#7.1 Q?#2.3), Connectors (J?.1)
FRIDGE: Controller (MOD?#1.20), Output (R?#3.1 R?#4.1)
FRIDGE_CON: Output (D?#4.1 Q?#1.3), Connectors (J?.2)
VBAT: Output (Q?#1.2 Q?#2.2), Power_Top (D?#8.1 Q?#3.2 R?#8.1)
VBAT_CON: Power_Top (F?.1), Connectors (J?.3)
VBAT_MON: Controller (MOD?#1.5), Power_Top (C?#2.1 R?#8.2 R?#9.1)